# Altium project Beagle93.PrjPCB (part 5 of 5)
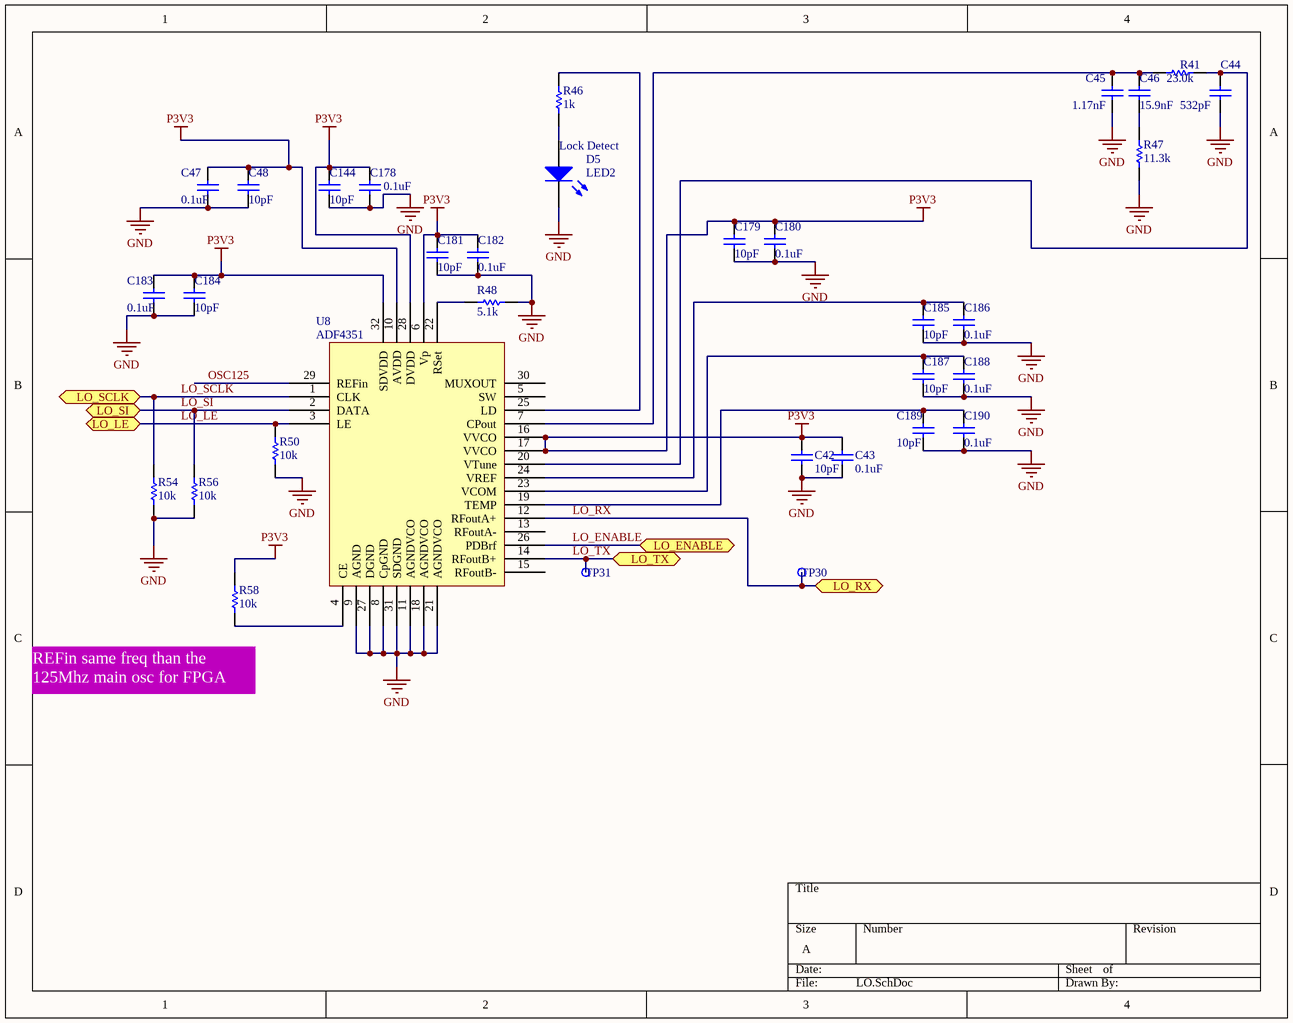
[diagram p11: LO.SchDoc]

## Nets that join several sheets
5V: PowerSupplies (14 pins), adc (6 pins), main (EXP.2)
DXN_0: TOP (7 pins), FPGA (11 pins), PowerSupplies (57 pins), FPGAPower&Misc (168 pins), FPGA_SDRAM (46 pins), adc (45 pins), dac (13 pins), avr (13 pins), main (12 pins), ethernet (26 pins), LO (33 pins)
MGTAVCC: PowerSupplies (C148.2 L15.2), FPGAPower&Misc (10 pins)
MGTAVTT: FPGA (R191.1), PowerSupplies (L18.2 L19.2), FPGAPower&Misc (13 pins)
P1V0: PowerSupplies (6 pins), FPGAPower&Misc (29 pins)
P1V5: PowerSupplies (L17.2 R61.1 TP10.1), FPGAPower&Misc (14 pins), FPGA_SDRAM (29 pins)
P1V8: PowerSupplies (6 pins), FPGAPower&Misc (L4.1), main (EXP.1 U12.3 U12.6)
P2V5: TOP (10 pins), FPGA (R42.2), PowerSupplies (9 pins), FPGAPower&Misc (63 pins), main (C201.1 U201.5)
VCC: TOP (C161.2 U2.2), FPGA (R11.2 R20.2 R44.2), PowerSupplies (9 pins), FPGAPower&Misc (R55.2), FPGA_SDRAM (C172.2 IC9.7 IC9.10 R127.2), avr (12 pins), main (C207.2 U12.7 U205.7 U205.8), ethernet (27 pins), LO (19 pins)
VCCAUX: PowerSupplies (C233.2 L26.2), FPGAPower&Misc (13 pins)
VCCBRAM: PowerSupplies (C149.2 L13.2), FPGAPower&Misc (8 pins)
ADC_CLKN: FPGA (IC4#2.AA3), adc (C12.1)
ADC_CLKOUT: FPGA (IC4#2.V4), adc (U3.43)
ADC_CLKP: FPGA (IC4#2.Y3), adc (C11.2)
ADC_D0: FPGA (IC4#2.W5), adc (U3.44)
ADC_D1: FPGA (IC4#2.U6), adc (U3.45)
ADC_D2: FPGA (IC4#2.V5), adc (U3.46)
ADC_D3: FPGA (IC4#2.R6), adc (U3.47)
ADC_D4: FPGA (IC4#2.T6), adc (U3.51)
ADC_D5: FPGA (IC4#2.Y6), adc (U3.52)
ADC_D6: FPGA (IC4#2.AA6), adc (U3.53)
ADC_D7: FPGA (IC4#2.V7), adc (U3.54)
ADC_D8: FPGA (IC4#2.W7), adc (U3.55)
ADC_D9: FPGA (IC4#2.AB7), adc (U3.56)
ADC_D10: FPGA (IC4#2.AB6), adc (U3.60)
ADC_D11: FPGA (IC4#2.V9), adc (U3.61)
ADC_OVR: FPGA (IC4#2.AB8), adc (U3.64)
ADC_RESET: FPGA (IC4#2.Y8), adc (R1.1 U3.35)
ADC_SCLK: FPGA (IC4#2.W9), adc (U3.2)
ADC_SDATA: FPGA (IC4#2.Y9), adc (U3.3)
ADC_SEN: FPGA (IC4#2.U7), adc (U3.4)
AVR_nRESET: FPGA (IC4#2.T3), avr (J2.5 R33.2 S1.1 U9.29)
CFG_CCLK: TOP (U2.16), FPGAPower&Misc (IC4#2.L12)
CFG_D02: TOP (R96.1 U2.9), FPGA (IC4#1.P21)
CFG_D03: TOP (R94.1 U2.1), FPGA (IC4#1.R21)
CFG_DIN: TOP (U303.6), FPGA (IC4#1.R22)
CFG_FCS: TOP (R95.1 U2.7), FPGA (IC4#1.T19)
CFG_MOSI: TOP (U2.15), FPGA (IC4#1.P22)
CK_FPGAIO_P: TOP (U25.3), FPGA (IC4#1.Y18)
DAC_CLK: FPGA (IC4#2.AB3), dac (U701.28)
DAC_D0: FPGA (IC4#2.T1), dac (U701.14)
DAC_D1: FPGA (IC4#2.U1), dac (U701.13)
DAC_D2: FPGA (IC4#2.U2), dac (U701.12)
DAC_D3: FPGA (IC4#2.V2), dac (U701.11)
DAC_D4: FPGA (IC4#2.R3), dac (U701.10)
DAC_D5: FPGA (IC4#2.R2), dac (U701.9)
DAC_D6: FPGA (IC4#2.W2), dac (U701.8)
DAC_D7: FPGA (IC4#2.Y2), dac (U701.7)
DAC_D8: FPGA (IC4#2.W1), dac (U701.6)
DAC_D9: FPGA (IC4#2.Y1), dac (U701.5)
DAC_D10: FPGA (IC4#2.U3), dac (U701.4)
DAC_D11: FPGA (IC4#2.V3), dac (U701.3)
DAC_D12: FPGA (IC4#2.AA1), dac (U701.2)
DAC_D13: FPGA (IC4#2.AB1), dac (U701.1)
DAC_SLEEP: FPGA (IC4#2.AB2), dac (U701.15)
ENET_RXD_N: FPGA (IC4#2.H14), ethernet (RA2.1)
ENET_RXD_P: FPGA (IC4#2.J14), ethernet (RA2.3)
ENET_TXD_N: FPGA (IC4#2.G16), ethernet (RA1.3)
ENET_TXD_P: FPGA (IC4#2.G15), ethernet (RA1.1)
ENET_XTAL: FPGA (IC4#2.H18), ethernet (U5.5 U10.4)
ETH_CRS: FPGA (IC4#2.G18), ethernet (R29.2)
ETH_MDC: FPGA (IC4#2.H17), ethernet (U5.13)
ETH_MDIO: FPGA (IC4#2.H15), ethernet (R22.1 U5.12)
ETH_RST: FPGA (IC4#2.J15), ethernet (U5.15)
ETH_TX_EN: FPGA (IC4#2.G17), ethernet (R36.2)
FPGA_BEAGLE_0: FPGA (IC4#1.P14), main (EXP.3)
FPGA_BEAGLE_1: FPGA (IC4#1.R14), main (EXP.5)
FPGA_BEAGLE_2: FPGA (IC4#1.R18), main (EXP.7)
FPGA_BEAGLE_3: FPGA (IC4#1.T18), main (EXP.9)
FPGA_BEAGLE_6: FPGA (IC4#1.P17), main (EXP.15)
FPGA_BEAGLE_A: FPGA (IC4#1.P15), main (EXP.14)
FPGA_BEAGLE_B: FPGA (IC4#1.R16), main (EXP.22)
FPGA_DONE: FPGAPower&Misc (IC4#2.G11 R57.1 T4.1), main (U201.19)
FPGA_INIT_B: FPGAPower&Misc (IC4#2.U12 R53.2), main (U201.20)
FPGA_nPCLK_N: FPGA (IC4#2.E6), main (U205.5)
FPGA_PCLK_P: FPGA (IC4#2.F6), main (U205.6)
FPGA_SPI2_CS: FPGA (IC4#2.R4), main (EXP.11)
FPGA_SPI2_MISO: FPGA (IC4#2.T5), main (EXP.17)
FPGA_SPI2_MOSI: FPGA (IC4#2.T4), main (EXP.19)
FPGA_SPI2_SCLK: FPGA (IC4#2.U5), main (EXP.21)
FPGA_SPI_CS: FPGA (IC4#2.AB5), main (EXP.16)
FPGA_SPI_MISO: FPGA (IC4#2.AA4), main (EXP.18)
FPGA_SPI_MODE: TOP (U304.4), main (U201.16)
FPGA_SPI_MOSI: TOP (U303.3), FPGA (IC4#2.Y4), main (EXP.12)
FPGA_SPI_SCLK: FPGA (IC4#2.W4), main (EXP.20)
I2C2_SCL/GPIO_168: FPGA (IC4#1.N13), main (EXP.24 U201.2 U205.3)
I2C2_SDA/GPIO_183: FPGA (IC4#1.N14), main (EXP.23 U201.4 U205.2)
I2C_SW_SCL: TOP (JP3.1), FPGA (IC4#2.J16)
I2C_SW_SDA: TOP (JP3.2), FPGA (IC4#2.F15)
M1M2: TOP (U304.6), FPGAPower&Misc (IC4#2.U9 IC4#2.U10)
MCBSP3_DX: FPGA (IC4#1.U17), main (EXP.4)
MCSPI3_CS1: FPGA (IC4#2.AA5), main (EXP.13)
OMAP_FLASH_DRV_N: TOP (U303.4), main (U201.14)
RESETn: PowerSupplies (IC6.20 R51.1 T6.1 TP5.1), FPGAPower&Misc (R53.1)

## Assembly variants
standard: not fitted C9 C13 C159 C160 J24 L19 R43 TR1 TR1 U1; alternate parts R9 -> R0402_51R_1%_0.0625W_100PPM
with_baluns: not fitted C9 C13 C159 C160 J24 L19 R5 R13 R43 R80 U1